# Altium schematic sheet Sheet2.SchDoc: {Title}
size 840 x 594 mm; Date: 2018-01-17; ApprovedBy: {ApprovedBy}; CheckedBy: {TechnicalReference}; Author: {CreatedBy}; DocumentNumber: -; Revision: A; SheetNumber: 2; Title0: {Title0}; DocumentType: {DocumentType}; TechControl: {TechControl}; PageSetup: Record=PageOptions|CenterHorizontal=True|CenterVertical=True|PrintScale=0.96|XCorrection=1.00|YCorrection=1.00|PrintKind=1|BorderSize=5000000|LeftOffset=0|BottomOffset=0|Orientation=2|PaperLength=1000|PaperWidth=1000|Scale=100|PaperSource=7|PrintQuality=-4|MediaType=1|DitherType=10|PaperKind=A3|PrintScaleMode=1; Language: en; ResponsibleDept: DED; DocumentStatus: Released; DecimalNumber: -
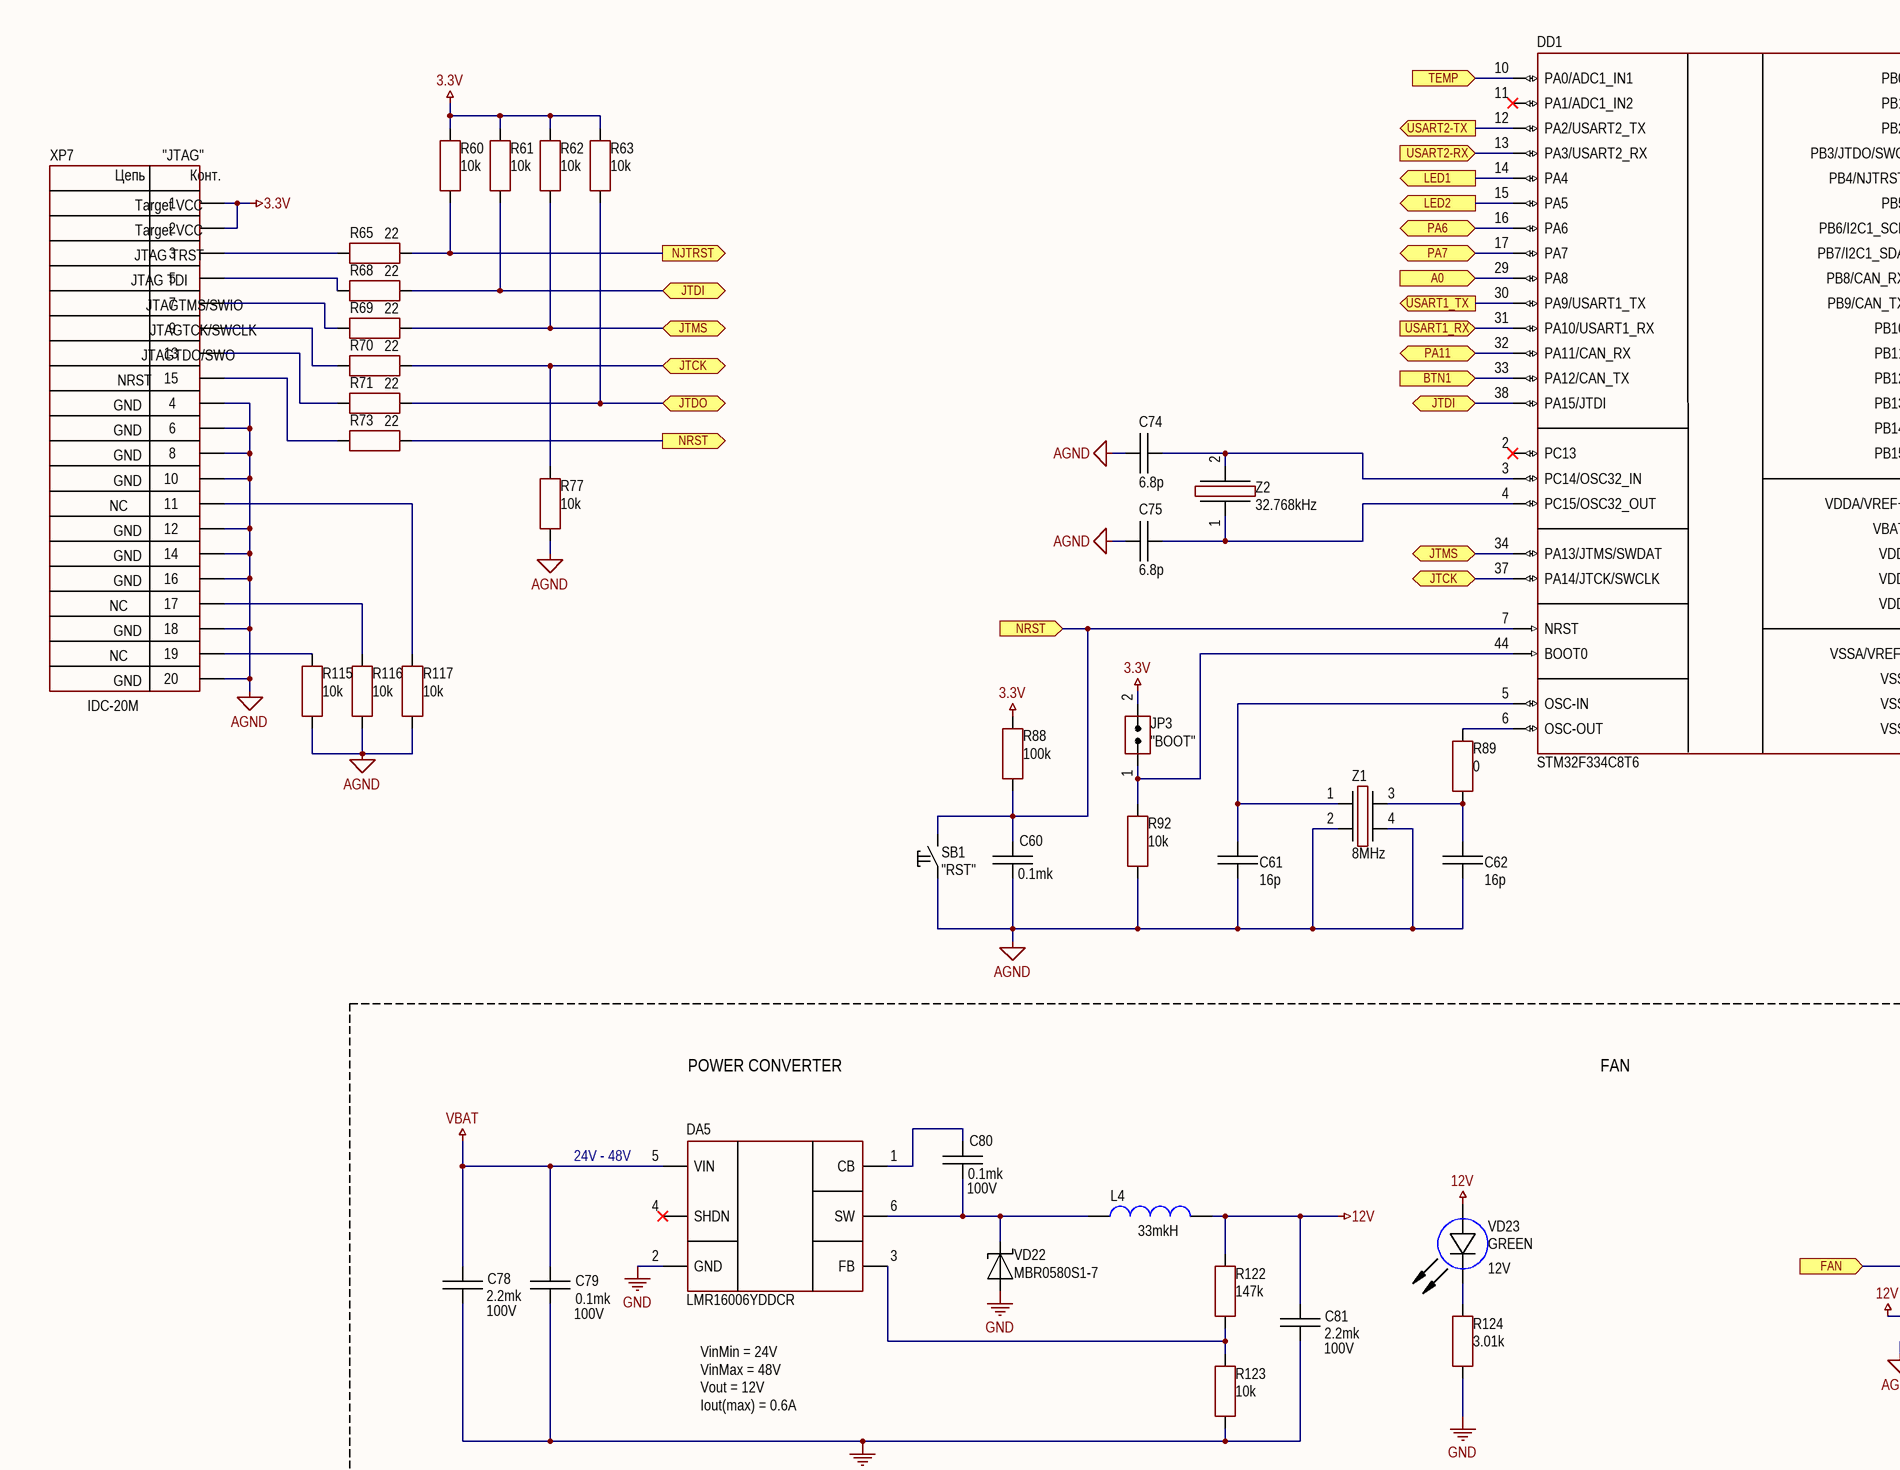
[diagram p0: Sheet2.SchDoc, top left]
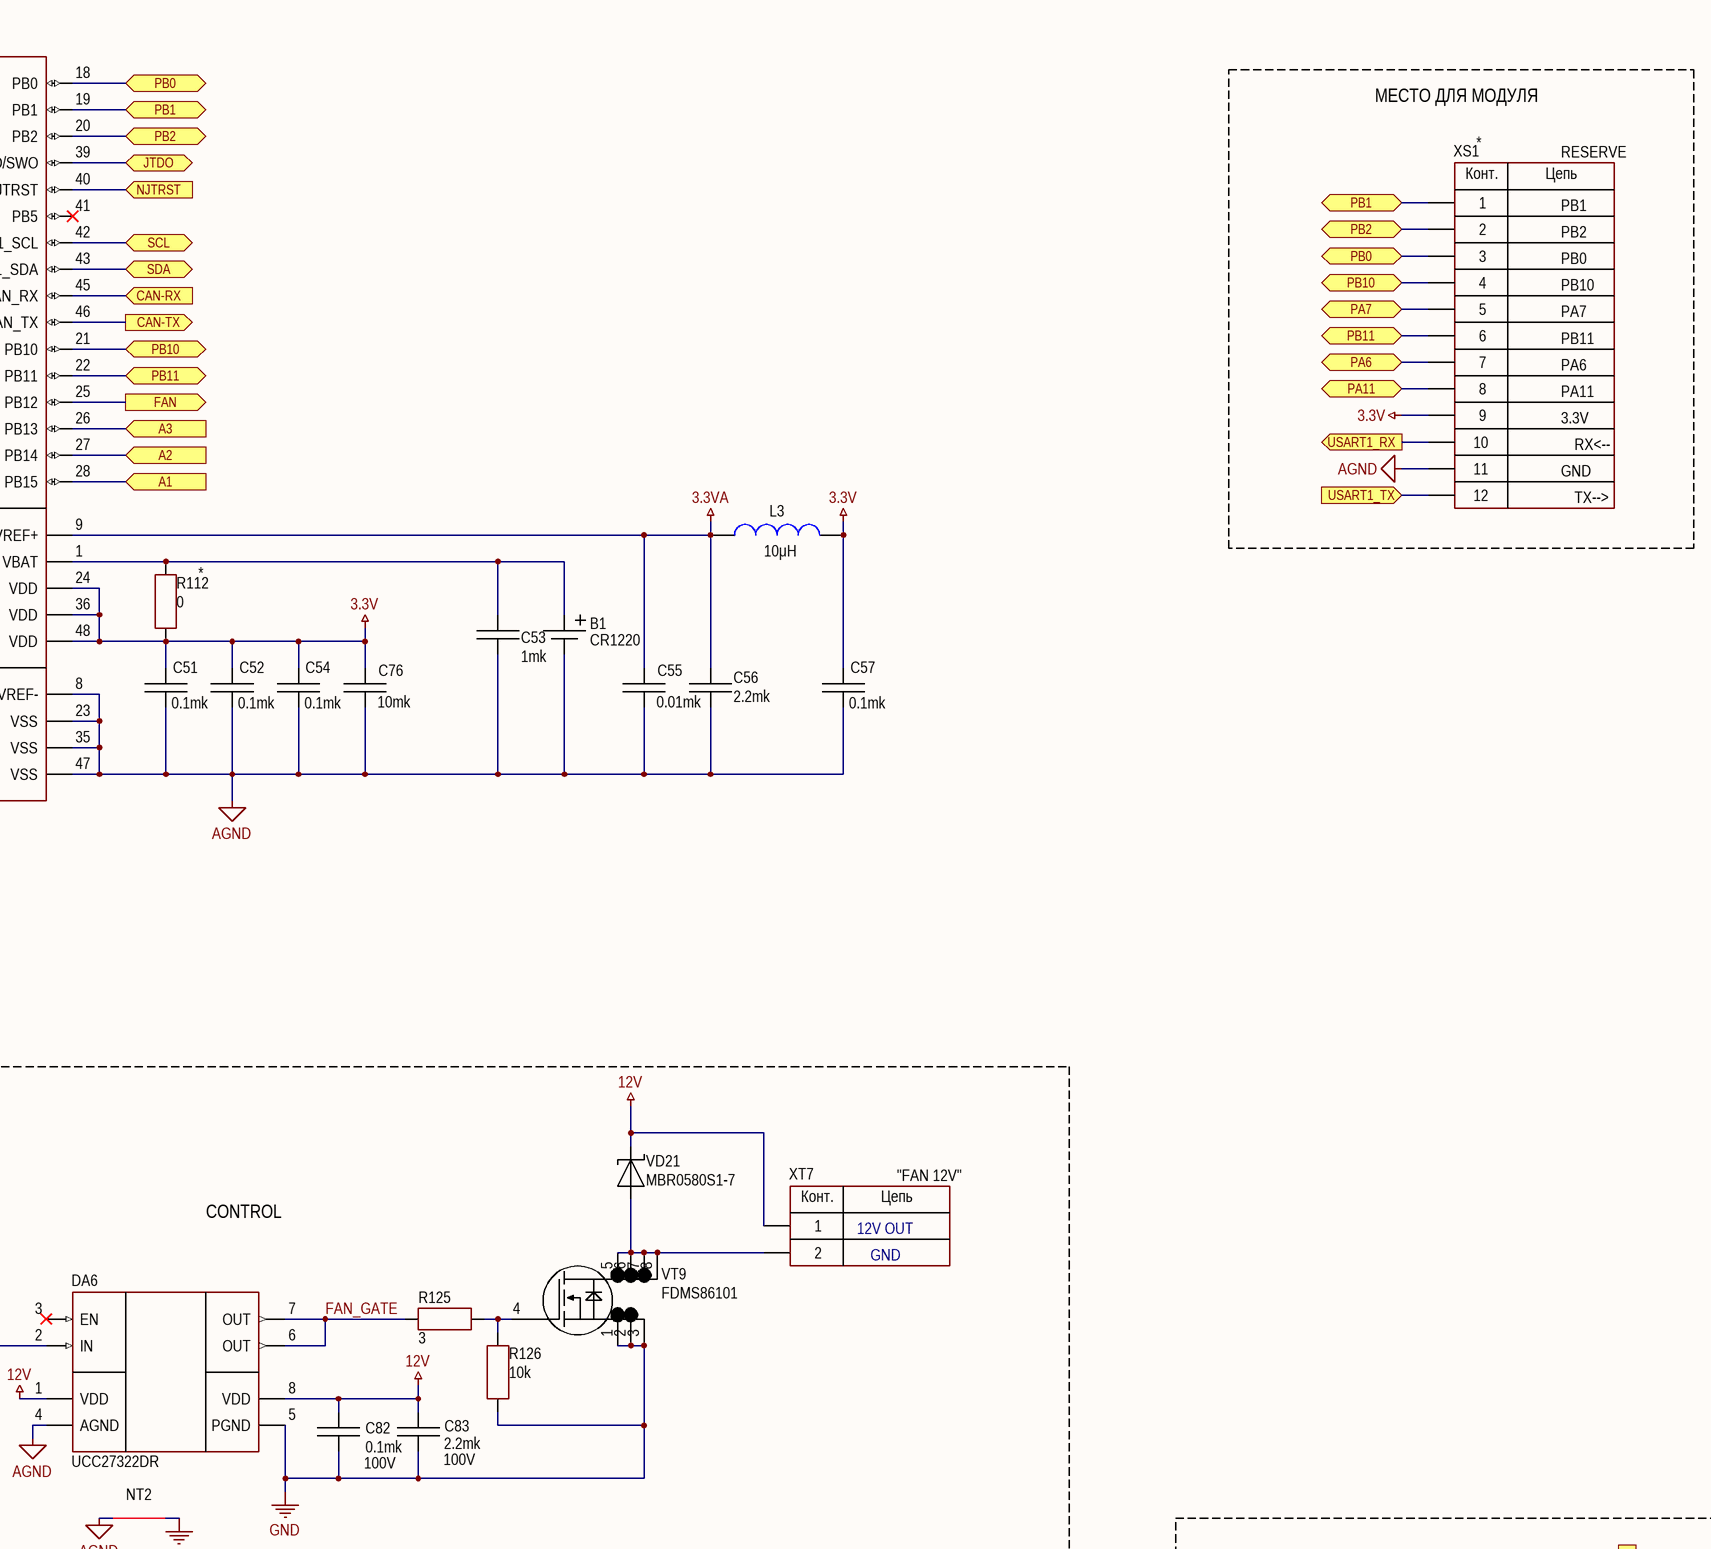
[diagram p1: Sheet2.SchDoc, top right]
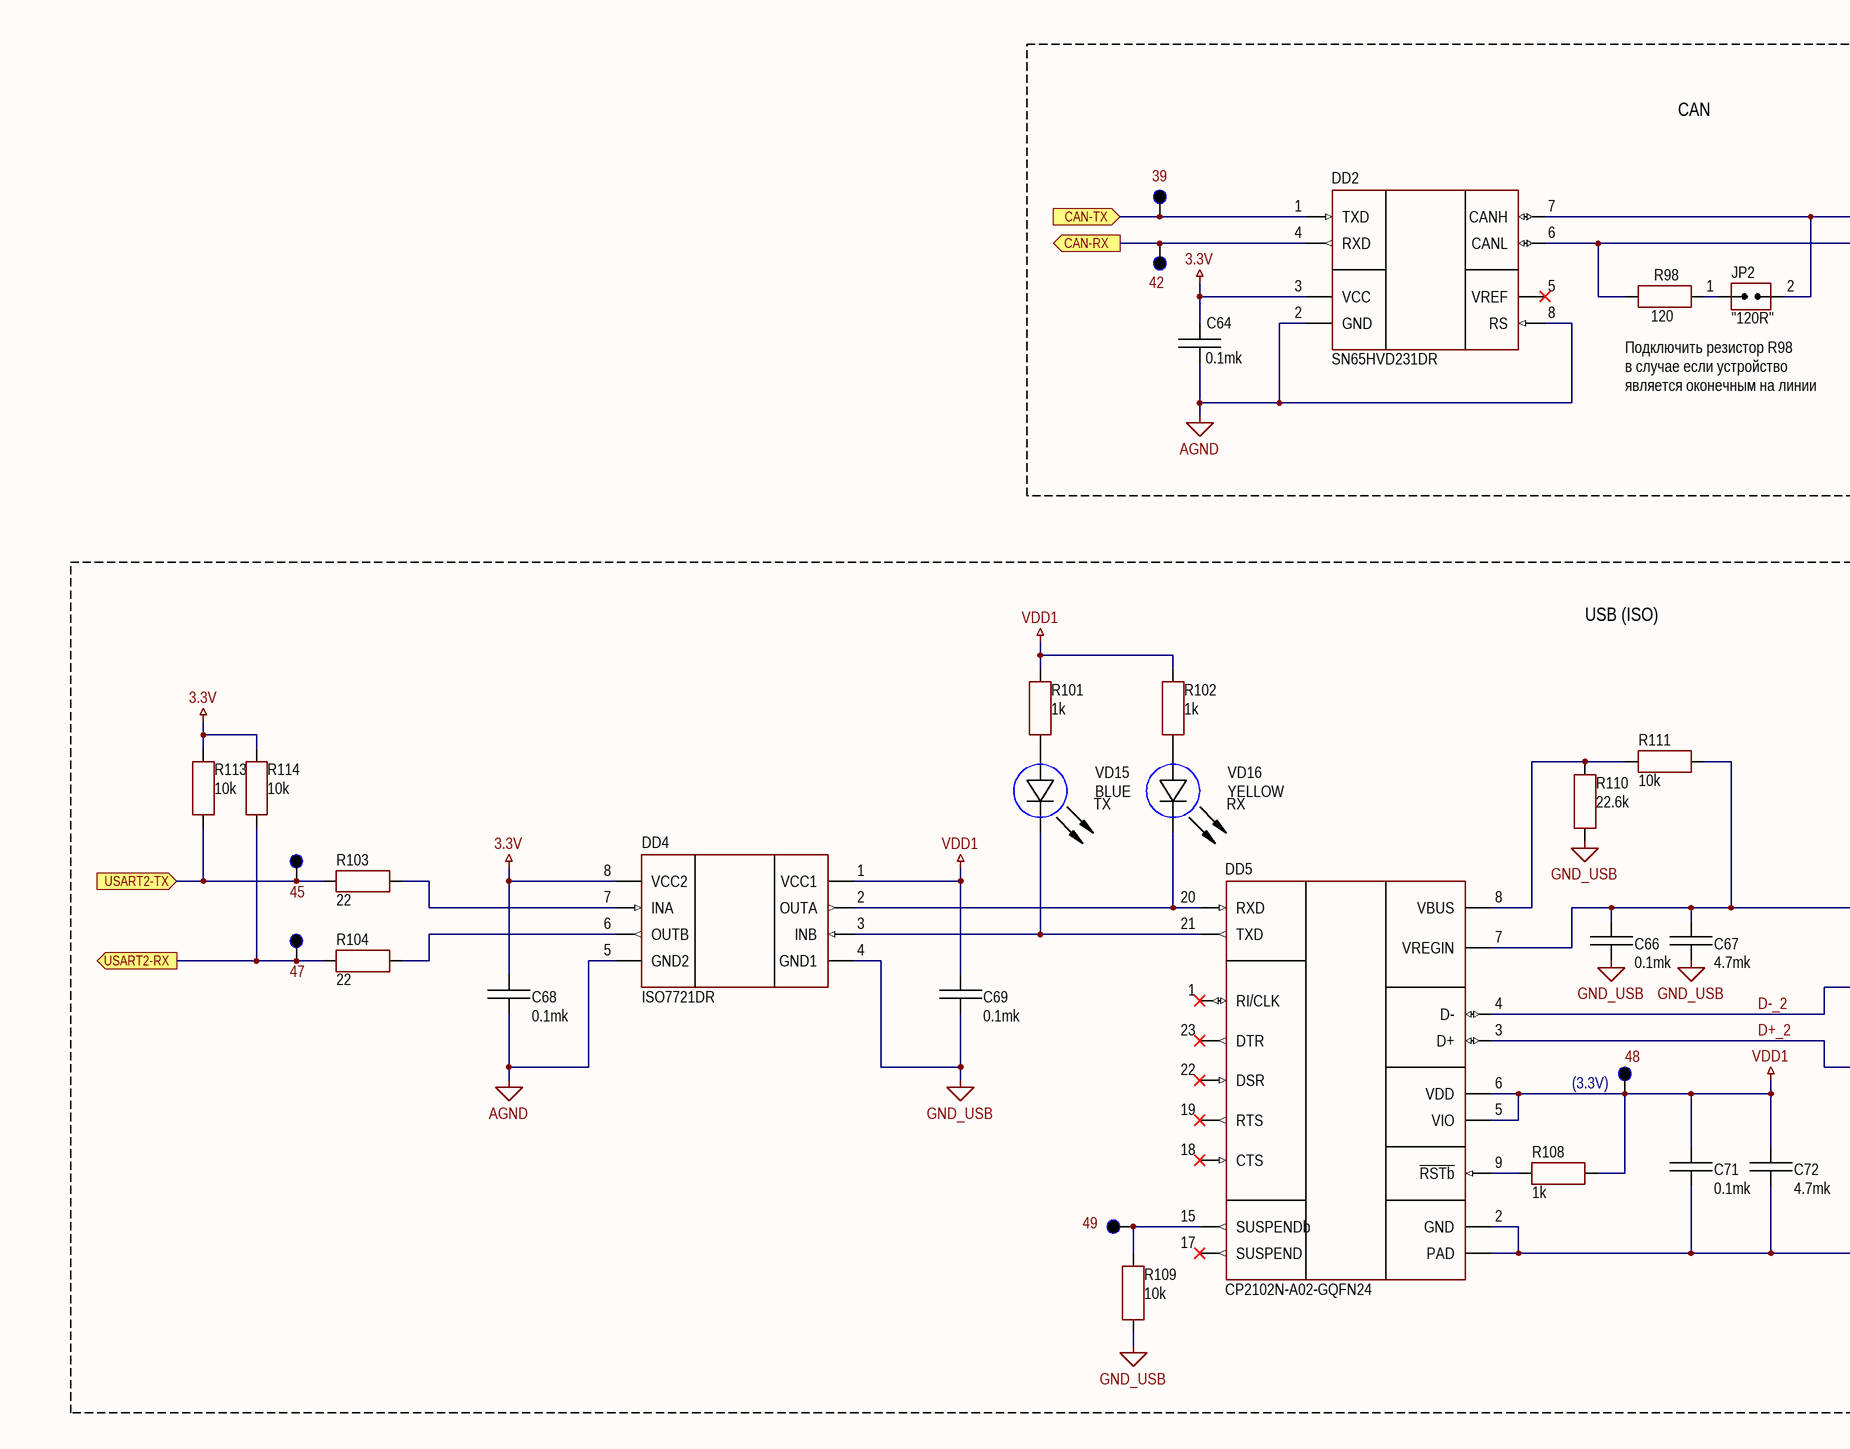
[diagram p2: Sheet2.SchDoc, bottom left]
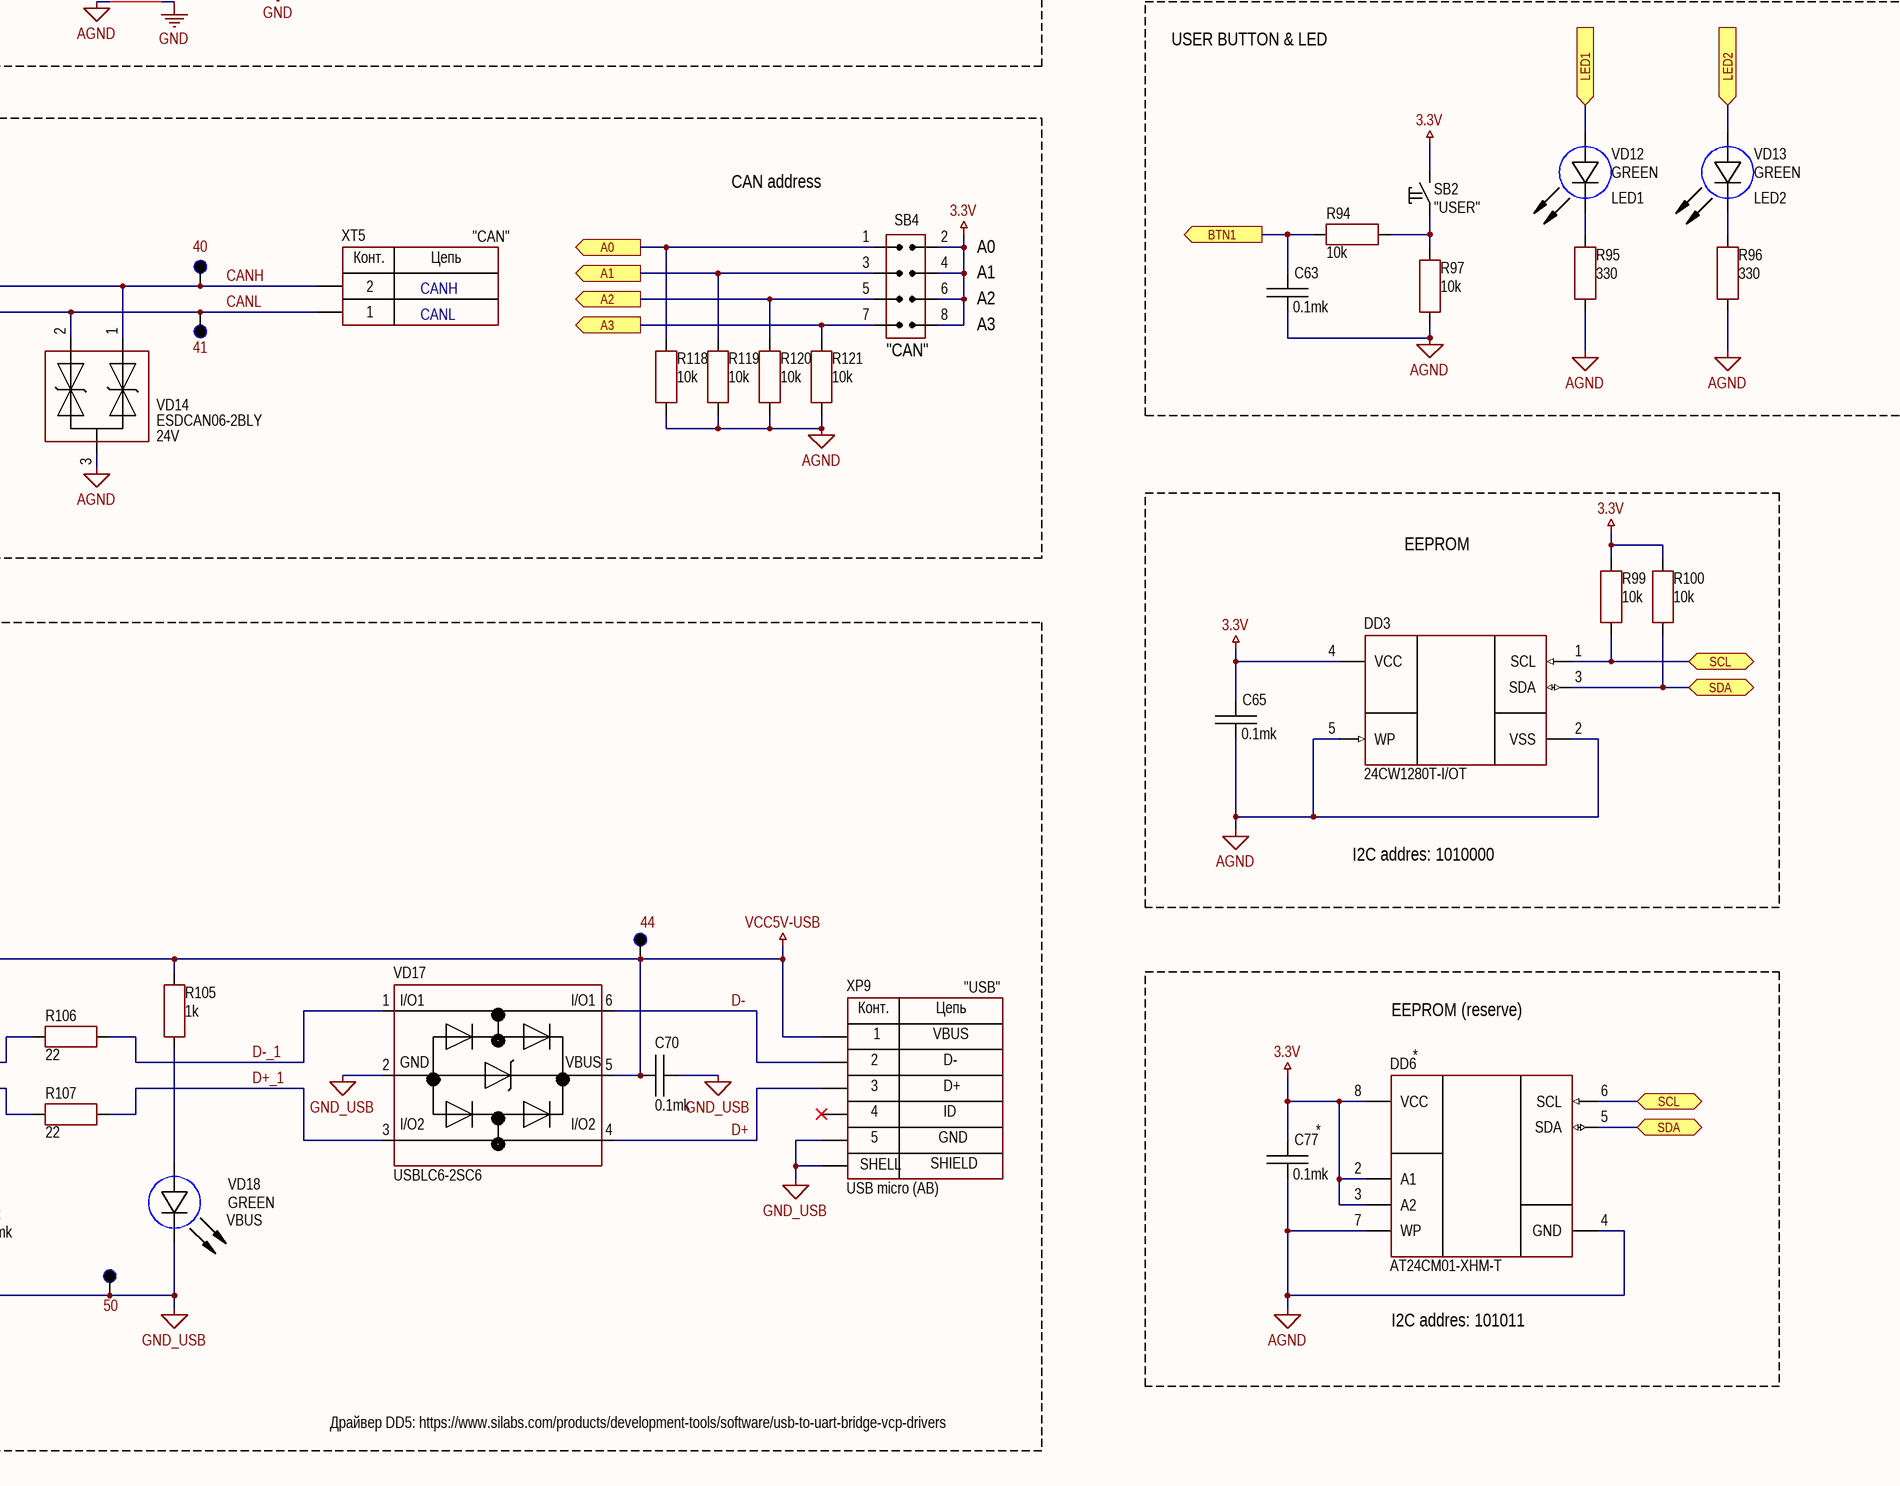
[diagram p3: Sheet2.SchDoc, bottom right]

## Parts
39  test  [TEST_point_SMD]  (value not drawn)  (no BOM)
40  test  [TEST_point_SMD]  (value not drawn)  (no BOM)
41  test  [TEST_point_SMD]  (value not drawn)  (no BOM)
42  test  [TEST_point_SMD]  (value not drawn)  (no BOM)
44  test  [TEST_point_SMD]  (value not drawn)  (no BOM)
45  test  [TEST_point_SMD]  (value not drawn)  (no BOM)
47  test  [TEST_point_SMD]  (value not drawn)  (no BOM)
48  test  [TEST_point_SMD]  (value not drawn)  (no BOM)
49  test  [TEST_point_SMD]  (value not drawn)  (no BOM)
50  test  [TEST_point_SMD]  (value not drawn)  (no BOM)
B1  CR1220  [BAT: S8411-45R]
C51  value 0.1mk  [CAP: 0603]
C52  value 0.1mk  [CAP: 0603]
C53  value 1mk  [CAP: 0603]
C54  value 0.1mk  [CAP: 0603]
C55  value 0.01mk  [CAP: 0603]
C56  value 2.2mk  [CAP: 0603]
C57  value 0.1mk  [CAP: 0603]
C60  value 0.1mk  [CAP: 0603]
C61  value 16p  [CAP: 0603]
C62  value 16p  [CAP: 0603]
C63  value 0.1mk  [CAP: 0603]
C64  value 0.1mk  [CAP: 0603]
C65  value 0.1mk  [CAP: 0603]
C66  value 0.1mk  [CAP: 0603]
C67  value 4.7mk  [CAP: 0805]
C68  value 0.1mk  [CAP: 0603]
C69  value 0.1mk  [CAP: 0603]
C70  value 0.1mk  [CAP: 0603]
C71  value 0.1mk  [CAP: 0603]
C72  value 4.7mk  [CAP: 0805]
C74  value 6.8p  [CAP: 0603]
C75  value 6.8p  [CAP: 0603]
C76  value 10mk  [CAP: 0603]
C77  value 0.1mk  [CAP: 0603]
C78  value 2.2mk  Voltage: 100V  [CAP: 1210]
C79  value 0.1mk  Voltage: 100V  [CAP: 0603]
C80  value 0.1mk  Voltage: 100V  [CAP: 0603]
C81  value 2.2mk  Voltage: 100V  [CAP: 1210]
C82  value 0.1mk  Voltage: 100V  [CAP: 0603]
C83  value 2.2mk  Voltage: 100V  [CAP: 1210]
DA5  (no value)  [SOT23-6 Thin]
DA6  PartNumber: UCC27322DR  [8-SOIC]
DD1  PartNumber: STM32F334C8T6  [48-LQFP]  (hidden comment: IC microcontroller, 32-Bit, Cortex-M4, 72MHz, 64KB, 12KB, 48-LQFP)
DD2  (no value)  [8-SOIC]
DD3  PartNumber: 24CW1280T-I/OT  [SOT23-5]
DD4  (no value)  [8-SOIC]
DD5  PartNumber: CP2102N-A02-GQFN24  [24-QFN]
DD6  EEPROM Memory IC 1Mb (128K x 8) I²C 1MHz 550ns 8-TSSOP  [8-TSSOP]  (value not drawn)
JP2  CommentText: "120R"  [CON: PLS-2]
JP3  CommentText: "BOOT"  [CON: PLS-2]
L3  value 10μH  [IND: 0805]
L4  value 33mkH  [IND: SRU8043]
NT2  (no value)  [NET_TIE]  (net tie, no BOM)
R60  value 10k  [RES: 0603]
R61  value 10k  [RES: 0603]
R62  value 10k  [RES: 0603]
R63  value 10k  [RES: 0603]
R65  value 22  [RES: 0603]
R68  value 22  [RES: 0603]
R69  value 22  [RES: 0603]
R70  value 22  [RES: 0603]
R71  value 22  [RES: 0603]
R73  value 22  [RES: 0603]
R77  value 10k  [RES: 0603]
R88  value 100k  [RES: 0603]
R89  value 0  [RES: 0603]
R92  value 10k  [RES: 0603]
R94  value 10k  [RES: 0603]
R95  value 330  [RES: 0603]
R96  value 330  [RES: 0603]
R97  value 10k  [RES: 0603]
R98  value 120  [RES: 0805]
R99  value 10k  [RES: 0603]
R100  value 10k  [RES: 0603]
R101  value 1k  [RES: 0603]
R102  value 1k  [RES: 0603]
R103  value 22  [RES: 0603]
R104  value 22  [RES: 0603]
R105  value 1k  [RES: 0603]
R106  value 22  [RES: 0603]
R107  value 22  [RES: 0603]
R108  value 1k  [RES: 0603]
R109  value 10k  [RES: 0603]
R110  value 22.6k  [RES: 0603]
R111  value 10k  [RES: 0603]
R112  value 0  [RES: 0603]
R113  value 10k  [RES: 0603]
R114  value 10k  [RES: 0603]
R115  value 10k  [RES: 0603]
R116  value 10k  [RES: 0603]
R117  value 10k  [RES: 0603]
R118  value 10k  [RES: 0603]
R119  value 10k  [RES: 0603]
R120  value 10k  [RES: 0603]
R121  value 10k  [RES: 0603]
R122  value 147k  [RES: 0603]
R123  value 10k  [RES: 0603]
R124  value 3.01k  [RES: 0603]
R125  value 3  [RES: 0603]
R126  value 10k  [RES: 0603]
SB1  CommentText: "RST"  [BUT: 6x6 SMD]
SB2  CommentText: "USER"  [BUT: 6x6 SMD]
SB4  (no value)  [BUT; SW4_1571983_4P_T]
VD12  Color: GREEN  ShowComment: LED1  [LED: 0603G]
VD13  Color: GREEN  ShowComment: LED2  [LED: 0603G]
VD14  Voltage: 24V  PartNumber: ESDCAN06-2BLY  [SOT23]
VD15  Color: BLUE  ShowComment: TX  [LED: 0603B]
VD16  Color: YELLOW  ShowComment: RX  [LED: 0603Y]
VD17  (no value)  [SOT23-6]
VD18  Color: GREEN  ShowComment: VBUS  [LED: 0603G]
VD21  PartNumber: MBR0580S1-7  [DIODE: SMA]
VD22  PartNumber: MBR0580S1-7  [DIODE: SMA]
VD23  Color: GREEN  ShowComment: 12V  [LED: 0603G]
VT9  PartNumber: FDMS86101  [PG-TDSON-8-7]
XP7  PartNumber: IDC-20M  CommentText: "JTAG"  [CON: IDC-20MS]
XP9  TypeConnector: USB micro (AB)  CommentText: "USB"  [CON: microUSB_0475890001]
XS1  CommentText: RESERVE  [CON: PBD-12]
XT5  CommentText: "CAN"  row1: CANH  row2: CANL  [CON: DG350-3.5-02P]
XT7  CommentText: "FAN 12V"  row1: 12V OUT  row2: GND  [CON: DG350-3.5-02P]
Z1  Frequency: 8MHz  [OSC: ECX-53B (3.2x5)]
Z2  Frequency: 32.768kHz  [OSC: 3215]

## Blocks framed on the sheet
24V - 48V: C78-C83 DA5 DA6 L4 NT2 R122-R126 VD21-VD23 VT9 XT7
(3.3V): 44 45 47-50 C66-C72 DD4 DD5 R101-R111 R113 R114 VD15-VD18 XP9

## Ports
A0 (in), A0 (out), A1 (in), A1 (out), A2 (in), A2 (out), A3 (in), A3 (out), BTN1 (in), BTN1 (out), CAN-RX (in), CAN-RX (out), CAN-TX (in), CAN-TX (out), FAN (in), FAN (out), JTCK (bidir), JTDI (bidir), JTDO (bidir), JTMS (bidir), LED1 (in), LED1 (out), LED2 (in), LED2 (out), NJTRST (in), NJTRST (out), NRST (in), NRST (out), PA6 (bidir), PA7 (bidir), PA11 (bidir), PB0 (bidir), PB1 (bidir), PB2 (bidir), PB10 (bidir), PB11 (bidir), SCL (bidir), SDA (bidir), TEMP (in), USART1_RX (in), USART1_RX (out), USART1_TX (in), USART1_TX (out), USART2-RX (in), USART2-RX (out), USART2-TX (in), USART2-TX (out)

## Nets
3.3V: C51.2 C52.2 C54.2 C57.2 C64.2 C65.2 C68.1 C76.2 C77.2 DD1.24(VDD) DD1.36(VDD) DD1.48(VDD) DD2.3(VCC) DD3.4(VCC) DD4.8(VCC2) DD6.2(A1) DD6.3(A2) DD6.8(VCC) JP3.2(IN) L3.1 R60.2 R61.2 R62.2 R63.2 R88.2 R99.1 R100.1 R112.1 R113.2 R114.2 SB2.2 SB4.2(IN) SB4.4(IN) SB4.6(IN) SB4.8(IN) XP7.1 XP7.2 XS1.9
3.3VA: C55.2 C56.2 DD1.9(VDDA/VREF+) L3.2
12V: C81.2 C82.2 C83.2 DA6.1(VDD) DA6.8(VDD) L4.1 R122.2 VD21.2 VD23.1(A) XT7.1
AGND: B1.- C51.1 C52.1 C53.1 C54.1 C55.1 C56.1 C57.1 C60.1 C61.1 C62.1 C63.1 C64.1 C65.1 C68.2 C74.2 C75.2 C76.1 C77.1 DA6.4(AGND) DD1.8(VSSA/VREF-) DD1.23(VSS) DD1.35(VSS) DD1.47(VSS) DD2.2(GND) DD2.8(RS) DD3.2(VSS) DD3.5(WP) DD4.5(GND2) DD6.4(GND) DD6.7(WP) NT2.1 R77.1 R92.1 R95.1 R96.1 R97.1 R115.1 R116.1 R117.1 R118.1 R119.1 R120.1 R121.1 SB1.1 VD14.3 XP7.4 XP7.6 XP7.8 XP7.10 XP7.12 XP7.14 XP7.16 XP7.18 XP7.20 XS1.11 Z1.2 Z1.4
GND: C78.1 C79.1 C81.1 C82.1 C83.1 DA5.2(GND) DA6.5(PGND) NT2.2 R123.2 R124.1 R126.2 VD22.1 VT9.1(S) VT9.2(S) VT9.3(S)
GND_USB: 50.1 C66.2 C67.1 C69.2 C70.2 C71.2 C72.1 DD4.4(GND1) DD5.0(PAD) DD5.2(GND) R109.1 R110.2 VD17.2(GND) VD18.2(C) XP9.0 XP9.5
VBAT: C78.2 C79.2 DA5.5(VIN)
VCC5V-USB: 44.1 C66.1 C67.2 C70.1 DD5.7(VREGIN) R105.1 R111.2 VD17.5(VBUS) XP9.1
VDD1: 48.1 C69.1 C71.1 C72.2 DD4.1(VCC1) DD5.5(VIO) DD5.6(VDD) R101.1 R102.1 R108.1
A0: DD1.29(PA8) R118.2 SB4.1(IN) ; port A0
A1: DD1.28(PB15) R119.2 SB4.3(IN) ; port A1
A2: DD1.27(PB14) R120.2 SB4.5(IN) ; port A2
A3: DD1.26(PB13) R121.2 SB4.7(IN) ; port A3
BTN1: C63.2 DD1.33(PA12/CAN_TX) R94.2 ; port BTN1
CAN-RX: 42.1 DD1.45(PB8/CAN_RX) DD2.4(RXD) ; port CAN-RX
CAN-TX: 39.1 DD1.46(PB9/CAN_TX) DD2.1(TXD) ; port CAN-TX
CANH: 40.1 DD2.7(CANH) JP2.2(IN) VD14.1 XT5.2
CANL: 41.1 DD2.6(CANL) R98.2 VD14.2 XT5.1
D+: VD17.4(I/O2) XP9.3
D+_1: R107.2 VD17.3(I/O2)
D+_2: DD5.3(D+) R107.1
D-: VD17.6(I/O1) XP9.2
D-_1: R106.2 VD17.1(I/O1)
D-_2: DD5.4(D-) R106.1
FAN: DA6.2(IN) DD1.25(PB12) ; port FAN
FAN_GATE: DA6.6(OUT) DA6.7(OUT) R125.2
JTCK: DD1.37(PA14/JTCK/SWCLK) R70.1 R77.2 ; port JTCK
JTDI: DD1.38(PA15/JTDI) R61.1 R68.1 ; port JTDI
JTDO: DD1.39(PB3/JTDO/SWO) R63.1 R71.1 ; port JTDO
JTMS: DD1.34(PA13/JTMS/SWDAT) R62.1 R69.1 ; port JTMS
LED1: DD1.14(PA4) VD12.1(A) ; port LED1
LED2: DD1.15(PA5) VD13.1(A) ; port LED2
NJTRST: DD1.40(PB4/NJTRST) R60.1 R65.1 ; port NJTRST
NRST: C60.2 DD1.7(NRST) R73.1 R88.1 SB1.2 ; port NRST
PA6: DD1.16(PA6) XS1.7 ; port PA6
PA7: DD1.17(PA7) XS1.5 ; port PA7
PA11: DD1.32(PA11/CAN_RX) XS1.8 ; port PA11
PB0: DD1.18(PB0) XS1.3 ; port PB0
PB1: DD1.19(PB1) XS1.1 ; port PB1
PB2: DD1.20(PB2) XS1.2 ; port PB2
PB10: DD1.21(PB10) XS1.4 ; port PB10
PB11: DD1.22(PB11) XS1.6 ; port PB11
SCL: DD1.42(PB6/I2C1_SCL) DD3.1(SCL) DD6.6(SCL) R99.2 ; port SCL
SDA: DD1.43(PB7/I2C1_SDA) DD3.3(SDA) DD6.5(SDA) R100.2 ; port SDA
TEMP: DD1.10(PA0/ADC1_IN1) ; port TEMP
USART1_RX: DD1.31(PA10/USART1_RX) XS1.10 ; port USART1_RX
USART1_TX: DD1.30(PA9/USART1_TX) XS1.12 ; port USART1_TX
USART2-RX: 47.1 DD1.13(PA3/USART2_RX) R104.1 R114.1 ; port USART2-RX
USART2-TX: 45.1 DD1.12(PA2/USART2_TX) R103.1 R113.1 ; port USART2-TX
Net49_1: 49.1 DD5.15(SUSPENDb) R109.2
NetB1_+: B1.+ C53.2 DD1.1(VBAT) R112.2
NetC61_2: C61.2 DD1.5(OSC-IN) Z1.1
NetC62_2: C62.2 R89.2 Z1.3
NetC74_1: C74.1 DD1.3(PC14/OSC32_IN) Z2.2
NetC75_1: C75.1 DD1.4(PC15/OSC32_OUT) Z2.1
NetC80_1: C80.1 DA5.6(SW) L4.2 VD22.2
NetC80_2: C80.2 DA5.1(CB)
NetDA5_3: DA5.3(FB) R122.1 R123.1
NetDD1_6: DD1.6(OSC-OUT) R89.1
NetDD1_44: DD1.44(BOOT0) JP3.1(IN) R92.2
NetDD4_2: DD4.2(OUTA) DD5.20(RXD) VD16.2(C)
NetDD4_3: DD4.3(INB) DD5.21(TXD) VD15.2(C)
NetDD4_6: DD4.6(OUTB) R104.2
NetDD4_7: DD4.7(INA) R103.2
NetDD5_8: DD5.8(VBUS) R110.1 R111.1
NetDD5_9: DD5.9(~{RSTb}) R108.2
NetJP2_1: JP2.1(IN) R98.1
NetR65_2: R65.2 XP7.3
NetR68_2: R68.2 XP7.5
NetR69_2: R69.2 XP7.7
NetR70_2: R70.2 XP7.9
NetR71_2: R71.2 XP7.13
NetR73_2: R73.2 XP7.15
NetR94_1: R94.1 R97.2 SB2.1
NetR95_2: R95.2 VD12.2(C)
NetR96_2: R96.2 VD13.2(C)
NetR101_2: R101.2 VD15.1(A)
NetR102_2: R102.2 VD16.1(A)
NetR105_2: R105.2 VD18.1(A)
NetR115_2: R115.2 XP7.19
NetR116_2: R116.2 XP7.17
NetR117_2: R117.2 XP7.11
NetR124_2: R124.2 VD23.2(C)
NetR125_1: R125.1 R126.1 VT9.4(G)
NetVD21_1: VD21.1 VT9.5(D) VT9.6(D) VT9.7(D) VT9.8(D) XT7.2

Not connected (* = marked no-connect by the designer): DA5 4(SHDN)*; DA6 3(EN)*; DD1 2(PC13)* 11(PA1/ADC1_IN2)* 41(PB5)*; DD2 5(VREF)*; DD5 1(RI/CLK)* 17(SUSPEND)* 18(CTS)* 19(RTS)* 22(DSR)* 23(DTR)*; XP9 4*

## Notes on the sheet
- МЕСТО ДЛЯ МОДУЛЯ РАСШИРЕНИЯ
- (near XS1) *
- Target VCC
- PB1
- JTAG TRST
- PB2
- PB0
- PB10
- JTAG TDI
- JTAGTMS/SWIO
- (near XP7) JTAGTCK/SWCLK
- PA7
- PB11
- NRST
- JTAGTDO/SWO
- PA6
- PA11
- 3.3V
- GND
- RX<--
- NC
- TX-->
- (near R112) *
- POWER CONVERTER
- FAN
- CONTROL
- VinMin = 24V
  VinMax = 48V
  Vout = 12V
  Iout(max) = 0.6A
- USER BUTTON & LED
- CAN
- CAN address
- A0
- A1
- A2
- (near SB4) "CAN"
- A3
- Подключить резистор R98
  в случае если устройство
  является оконечным на линии
- (near R99) EEPROM
- USB (ISO)
- I2C addres: 1010000
- EEPROM (reserve)
- (near DD6) *
- (near C77) *
- I2C addres: 101011
- Драйвер DD5: https://www.silabs.com/products/development-tools/software/usb-to-uart-bridge-vcp-drivers
- Перв. примен.
- Справ. №
- Подп. и дата
- Инв. № дубл.
- Взам. инв. №
- Инв. № подл.
- Изм.
- Лист
- № докум.
- Подп.
- Дата
- 2.106-A2
- Копировал
- Формат А1
- (in symbol Connector_terminal_2pin) Конт.; Цепь
- (in symbol Connector_USB_micro_AB) Конт.; Цепь; VBUS; D-; D+; ID; GND; SHELL; SHIELD
- (in symbol IDC-20) Цепь; Конт.
- (in symbol PBD-12) Конт.; Цепь

## Library data of the parts
39-42 44 45 47-50 = TEST point: Контактная площадка без компонента
B1 = CR1220: Holder: S8411-45R HARWIN; Value: 3V; Battery: CR1220 MFR.SC "RENATA"; HolderAnalog: KLS5-CR1220-02; Pattern/Footprint: CR1220; HelpURL: https://www.electronshik.ru/item/RENATA/CR1220%20MFR.IB; HelpURL1: https://www.digikey.com/product-detail/en/harwin-inc/S8411-45R/952-1745-2-ND/3131055
C51 C52 C54 C57 C60 C63-C66 C68-C71 C77 = Ceramic_0603: Manufacturer: AVX; PartNumber: 0603YC104KAT2A; ValueManufacturerPartNumber: CAP CER, 0.1mk, X7R, ±10%, 16V, 0603; TypeCapacitor: CAP CER; Tolerance: ±10%; TypeDielectric: X7R; Voltage: 16V; Package: 0603; HelpURL: https://www.digikey.com/product-detail/en/avx-corporation/0603YC104KAT2A/478-1239-1-ND/564271; Temperature: -55...+125°C
  C70 C71: ClassName: Polygon_direct
C53 = Ceramic_0603: Manufacturer: AVX; PartNumber: 0603YC105KAT2A; ValueManufacturerPartNumber: CAP CER, 1mk, X7R, ±10%, 16V, 0603; TypeCapacitor: CAP CER; Tolerance: ±10%; TypeDielectric: X7R; Voltage: 16V; Package: 0603; HelpURL: https://www.digikey.com/product-detail/en/avx-corporation/0603YC105KAT2A/478-5010-1-ND/1888221; Temperature: -55...+125°C
C55 = Ceramic_0603: Manufacturer: AVX; PartNumber: 06031C103KAT2A; ValueManufacturerPartNumber: CAP CER, 0.01mk, X7R, ±10%, 100V, 0603; TypeCapacitor: CAP CER; Tolerance: ±10%; TypeDielectric: X7R; Voltage: 100V; Package: 0603; HelpURL: https://www.digikey.com/product-detail/en/avx-corporation/06031C103KAT2A/478-1205-2-ND/563315; Temperature: -55...+125°C
C56 = Ceramic_0603: Manufacturer: AVX; PartNumber: 0603ZD225KAT2A; ValueManufacturerPartNumber: CAP CER, 2.2mk, X5R, ±10%, 10V, 0603; TypeCapacitor: CAP CER; Tolerance: ±10%; TypeDielectric: X5R; Voltage: 10V; Package: 0603; HelpURL: https://www.digikey.com/product-detail/en/avx-corporation/0603ZD225KAT2A/478-6212-1-ND/2391411; Temperature: -55...+85°C
C61 C62 = Ceramic_0603: Manufacturer: AVX; PartNumber: 06035A160JAT2A; ValueManufacturerPartNumber: CAP CER, 16p, NP0, ±5%, 50V, 0603; TypeCapacitor: CAP CER; Tolerance: ±5%; TypeDielectric: NP0; Voltage: 50V; Package: 0603; HelpURL: https://www.digikey.com/product-detail/en/avx-corporation/06035A160JAT2A/478-10292-1-ND/6797449; Temperature: -55...+125°C
C67 C72 = Ceramic_0805: Manufacturer: AVX; PartNumber: 0805YC475KAT2A; ValueManufacturerPartNumber: CAP CER, 4.7mk, X7R, ±10%, 16V, 0805; TypeCapacitor: CAP CER; Tolerance: ±10%; TypeDielectric: X7R; Voltage: 16V; Package: 0805; HelpURL: https://www.digikey.com/product-detail/en/avx-corporation/0805YC475KAT2A/478-5722-1-ND/2136330; Temperature: -55...+125°C
C74 C75 = Ceramic_0603: Manufacturer: YAGEO; PartNumber: CC0603DRNPO9BN6R8; ValueManufacturerPartNumber: CAP CER, 6.8p, NP0, ±0.5pF, 50V, 0603; TypeCapacitor: CAP CER; Tolerance: ±0.5pF; TypeDielectric: NP0; Voltage: 50V; Package: 0603; HelpURL: https://www.electronshik.ru/item/YAG/CC0603DRNPO9BN6R8; Temperature: -55...+125°C
C76 = Ceramic_0603: Manufacturer: AVX; PartNumber: 0603ZD106MAT2A; ValueManufacturerPartNumber: CAP CER, 10mk, X5R, ±10%, 10V, 0603; TypeCapacitor: CAP CER; Tolerance: ±10%; TypeDielectric: X5R; Voltage: 10V; Package: 0603; HelpURL: https://www.digikey.com/product-detail/en/avx-corporation/0603ZD106MAT2A/478-8050-1-ND/3900666; Temperature: -55...+85°C
C78 C81 C83 = Ceramic_1210: Manufacturer: AVX; PartNumber: 12101C225KAT2A; ValueManufacturerPartNumber: CAP CER, 2.2mk, X7R, ±10%, 100V, 1210; TypeCapacitor: CAP CER; Tolerance: ±10%; TypeDielectric: X7R; Package: 1210; HelpURL: https://www.digikey.com/product-detail/en/avx-corporation/12101C225KAT2A/478-7974-1-ND/3881597; Temperature: -55...+125°C; ClassName: Polygon_direct
C79 C80 C82 = Ceramic_0603: Manufacturer: AVX; PartNumber: 06031C104KAT2A; ValueManufacturerPartNumber: CAP CER, 0.1mk, X7R, ±10%, 100V, 0603; TypeCapacitor: CAP CER; Tolerance: ±10%; TypeDielectric: X7R; Package: 0603; HelpURL: https://www.digikey.com/product-detail/en/avx-corporation/06031C104KAT2A/478-10047-1-ND/6564270; Temperature: -55...+125°C
  C79 C82: ClassName: Polygon_direct
DA5 = LMR16006YDDCR: Buck converter; Manufacturer: Texas Instruments; ValueManufacturerPartNumber: DC/DC buck converter, SOT23-6; VoltageInput: 4...60V; Frequency: 2.1MHz; CurrentOutput: 0.6A; VoltageOutput: 0.765...55V; HelpURL: https://www.digikey.com/product-detail/en/texas-instruments/LMR16006YDDCR/296-40294-1-ND/5178171; Package: SOT23-6; ComponentType: DC/DC buck converter; Temperature: -40...+125°C; PartNumber: LMR16006YDDCR; ClassName: Polygon_direct
DA6 = UCC27322D: Gate driver; Manufacturer: Texas Instruments; ValueManufacturerPartNumber: Low side gate driver, P+N channel, 500kHz, ±9A, supply 4...15V, -40...+125°C, 8-SOIC; VoltageSupply: supply 4...15V; Frequency: 500kHz; CurrentOutput: ±9A; VoltageWork: P+N channel; HelpURL: https://www.digikey.com/product-detail/en/texas-instruments/UCC27322D/296-13673-5-ND/509705; Package: 8-SOIC; ComponentType: Low side gate driver; Temperature: -40...+125°C; ClassName: Polygon_direct
DD1 = STM32F334C4T6: Cortex-M4; Manufacturer: STMicroelectronics; Supply: 2...3.6V; HelpURL: https://www.digikey.com/products/en?keywords=STM32F334C4T6; Package: 48-LQFP; ComponentType: IC microcontroller; ValueManufacturerPartNumber: IC microcontroller, 32-Bit, Cortex-M4, 72MHz, 64KB, 12KB, 48-LQFP; Temperature: -40...+85°C; Speed: 72MHz; CoreSize: 32-Bit; MemoryROM: 64KB; MemoryRAM: 12KB; CoreProcessor: Cortex-M4
DD2 = SN65HVD231DR: CAN; Manufacturer: Texas Instruments; ValueManufacturerPartNumber: IC CAN transceiver, 8-SOIC; Supply: 3...3.6V; DataRate: 1Mbps; TypeDuplex: Half-duplex; HelpURL: https://www.digikey.com/product-detail/en/texas-instruments/SN65HVD231DR/296-26343-1-ND/2254977; Package: 8-SOIC; ComponentType: IC CAN transceiver; Temperature: -40...+85°C; PartNumber: SN65HVD231DR
DD3 = 24AA01T: EEPROM; Manufacturer: Microchip Technology; ValueManufacturerPartNumber: EEPROM, 128KB (16Kx8), 400 kHz, I2C, SOT-23-5; Supply: 1.7...5.5V; Speed: 400 kHz; InterfaceData: I2C; MemorySize: 128KB (16Kx8); HelpURL: https://www.digikey.com/product-detail/en/microchip-technology/24CW1280T-I-OT/24CW1280T-I-OTDKR-ND/9607118; Package: SOT-23-5; ComponentType: EEPROM; Temperature: -40...+85°C
DD4 = ISO7721DR: Digital isolator; Manufacturer: Texas Instruments; ValueManufacturerPartNumber: IC digital isolator, 8-SOIC; Supply: 2.25...5.5V; DataRate: 100Mbps; Isolation: 3000Vrms; HelpURL: https://www.digikey.com/product-detail/en/texas-instruments/ISO7721DR/296-48296-1-ND/8347715; Package: 8-SOIC; ComponentType: IC digital isolator; Temperature: -55...+125°C; PartNumber: ISO7721DR
DD5 = CP2102N_QFN24: USB-to-UART; Manufacturer: Silicon Labs; ValueManufacturerPartNumber: USB Bridge, USB to UART, USB2.0, 24-QFN(4x4); Supply: 3...3.6V; HelpURL: https://www.digikey.com/product-detail/en/silicon-labs/CP2102N-A02-GQFN24/336-5887-ND/9863476; Package: 24-QFN(4x4); ComponentType: USB Bridge, USB to UART; Temperature: -40...+85°C; Standard: USB2.0
DD6 = AT24CM01-XHM-T: EEPROM; Manufacturer: Microchip Technology; Supply: 1.7...5.5V; InterfaceData: I2C; HelpURL: https://www.digikey.com/product-detail/en/microchip-technology/AT24CM01-XHM-T/AT24CM01-XHM-TTR-ND/3913189; Package: 8-TSSOP; ComponentType: EEPROM; ValueManufacturerPartNumber: EEPROM Memory IC 1Mb (128K x 8) I²C 1MHz 550ns 8-TSSOP; Temperature: -40...+85°C; Speed: 1MHz; MemorySize: 1Mb (128K x 8); PartNumber: AT24CM01-XHM-T
JP2 JP3 = Jumper_single: Manufacturer: Würth Elektronik; PartNumber: 61300411121; ValueManufacturerPartNumber: PLS-2 SINGLE ROW, 2pin, 2.54mm, 500VAC, 3A; CurrentMax: 3A; Multichannel: 2pin; Pitch: 2.54mm; TypeConnector: PLS-2 SINGLE ROW; VoltageMax: 500VAC; HelpURL: https://www.digikey.com/product-detail/en/w-rth-elektronik/61300411121/732-5317-ND/4846827
L3 = Inductor_0805: Manufacturer: Murata Electronics; PartNumber: LQM21DH100M70L; ValueManufacturerPartNumber: Fixed inductor, 10μH, ±20%, 0805, 250mA; TypeInductor: Fixed inductor; MaxCurrent: 250mA; Tolerance: ±20%; Package: 0805; HelpURL: https://www.digikey.com/product-detail/en/murata-electronics/LQM21DH100M70L/490-18463-1-ND/10135474; Temperature: -55...+125°C
L4 = Inductor_R22.9/14/7.62: Manufacturer: Bourns Inc.; PartNumber: SRU8043-330Y; ValueManufacturerPartNumber: Fixed inductor, 33mkH, ±15%, SMD Nonstandard, Ferrite, , 1.7A; TypeInductor: Fixed inductor; TypeMatiriel: Ferrite; Current: 1.7A; Tolerance: ±15%; Package: SMD Nonstandard; HelpURL: https://www.digikey.com/product-detail/en/bourns-inc/SRU8043-330Y/SRU8043-330YCT-ND/2353063; ClassName: Polygon_direct
NT2 = NetTie: ClassName: Polygon_direct
R60-R63 R77 R92 R94 R97 R99 R100 R109 R111 R113-R121 R123 R126 = Resistor_0603: Manufacturer: Vishay; PartNumber: CRCW060310K0JNEAC; ValueManufacturerPartNumber: Res, SMD, 10k, ±5%, 0603, 0.1W; TypeResistor: Res, SMD; Power: 0.1W; Tolerance: ±5%; Package: 0603; HelpURL: https://www.digikey.com/product-detail/en/vishay-dale/CRCW060310K0JNEAC/541-3957-1-ND/7928640; Temperature: -55...+125°C
R65 R68-R71 R73 R103 R104 R106 R107 = Resistor_0603: Manufacturer: Vishay; PartNumber: CRCW060322R0JNEA; ValueManufacturerPartNumber: Res, SMD, 22, ±5%, 0603, 0.1W; TypeResistor: Res, SMD; Power: 0.1W; Tolerance: ±5%; Package: 0603; HelpURL: https://www.digikey.com/product-detail/en/vishay-dale/CRCW060322R0JNEA/541-22GCT-ND/1179329; Temperature: -55...+125°C
R88 = Resistor_0603: Manufacturer: Vishay; PartNumber: CRCW0603100KFKEA; ValueManufacturerPartNumber: Res, SMD, 100k, ±1%, 0603, 0.1W; TypeResistor: Res, SMD; Power: 0.1W; Tolerance: ±1%; Package: 0603; HelpURL: https://www.digikey.com/product-detail/en/vishay-dale/CRCW0603100KFKEA/541-100KHCT-ND/1180038; Temperature: -55...+125°C
R89 R112 = Resistor_0603: Manufacturer: Vishay; PartNumber: CRCW06030000Z0EA; ValueManufacturerPartNumber: Res, SMD, 0, ±1%, 0603, 0.1W; TypeResistor: Res, SMD; Power: 0.1W; Tolerance: ±1%; Package: 0603; HelpURL: https://www.digikey.com/product-detail/en/vishay-dale/CRCW06030000Z0EA/541-0.0GCT-ND/1179296; Temperature: -55...+125°C
R95 R96 = Resistor_0603: Manufacturer: Vishay; PartNumber: CRCW0603330RFKEAC; ValueManufacturerPartNumber: Res, SMD, 330, ±1%, 0603, 0.1W; TypeResistor: Res, SMD; Power: 0.1W; Tolerance: ±1%; Package: 0603; HelpURL: https://www.digikey.com/product-detail/en/vishay-dale/CRCW0603330RFKEAC/541-4026-1-ND/7928709; Temperature: -55...+125°C
R98 = Resistor_0805: Manufacturer: Vishay; PartNumber: CRCW0805120RJNEA; ValueManufacturerPartNumber: Resistor film, 120, ±5%, 0805, 0.125W; TypeResistor: Resistor film; Power: 0.125W; Tolerance: ±5%; Package: 0805; HelpURL: https://www.digikey.com/product-detail/en/vishay-dale/CRCW0805120RJNEA/541-120ACT-ND/1180318; Temperature: -55...+125°C
R101 R102 R105 R108 = Resistor_0603: Manufacturer: Vishay; PartNumber: CRCW06031K00FKEA; ValueManufacturerPartNumber: Res, SMD, 1k, ±1%, 0603, 0.1W; TypeResistor: Res, SMD; Power: 0.1W; Tolerance: ±1%; Package: 0603; HelpURL: https://www.digikey.com/product-detail/en/vishay-dale/CRCW06031K00FKEA/541-1.00KHCT-ND/1179809; Temperature: -55...+125°C
  R105: ClassName: Polygon_direct
R110 = Resistor_0603: Manufacturer: Vishay; PartNumber: CRCW060322K6FKEA; ValueManufacturerPartNumber: Res, SMD, 22.6k, ±1%, 0603, 0.1W; TypeResistor: Res, SMD; Power: 0.1W; Tolerance: ±1%; Package: 0603; HelpURL: https://www.digikey.com/product-detail/en/vishay-dale/CRCW060322K6FKEA/541-22.6KHCT-ND/1179962; Temperature: -55...+125°C
R122 = Resistor_0603: Manufacturer: YAGEO; PartNumber: RC0603FR-07147KL; ValueManufacturerPartNumber: Res, SMD, 147k, ±1%, 0603, 0.1W; TypeResistor: Res, SMD; Power: 0.1W; Tolerance: ±1%; Package: 0603; HelpURL: https://www.electronshik.ru/item/YAG/RC0603FR-07147KL; Temperature: -55...+125°C
R124 = Resistor_0603: Manufacturer: Vishay; PartNumber: CRCW06033K01FKEA; ValueManufacturerPartNumber: Res, SMD, 3.01k, ±1%, 0603, 0.1W; TypeResistor: Res, SMD; Power: 0.1W; Tolerance: ±1%; Package: 0603; HelpURL: https://www.digikey.com/product-detail/en/vishay-dale/CRCW06033K01FKEA/541-3.01KHCT-ND/1179862; Temperature: -55...+125°C
R125 = Resistor_0603: Manufacturer: Vishay; PartNumber: CRCW06033R00JNEA; ValueManufacturerPartNumber: Res, SMD, 3, ±5%, 0603, 0.1W; TypeResistor: Res, SMD; Power: 0.1W; Tolerance: ±5%; Package: 0603; HelpURL: https://www.digikey.com/product-detail/en/vishay-dale/CRCW06033R00JNEA/541-3.0GCT-ND/1179308; Temperature: -55...+125°C
SB1 SB2 = Button_tactile: Manufacturer: TE Connectivity; ValueManufacturerPartNumber: Tactile button, 6x6mm; PartNumber: FSM2JSMAATR; TypeButton: Tactile button; HelpURL: https://www.digikey.com/product-detail/en/te-connectivity-alcoswitch-switches/FSM2JSMAATR/450-1792-1-ND/3503931; Package: 6x6mm
SB4 = Button_switch: Manufacturer: TE Connectivity; ValueManufacturerPartNumber: DIP switch, 4pin, 24VDC, 25mA, -40...+85°C; PartNumber: 1571983-4; TypeButton: DIP switch; VoltageMax: 24VDC; CurrentMax: 25mA; Multichannel: 4pin; HelpURL: https://www.chipdip.ru/product/tyco-1571983-4; Temperature: -40...+85°C
VD12 VD13 VD18 VD23 = LED_single: Manufacturer: Wurth; ValueManufacturerPartNumber: LED, 0603, GREEN; PartNumber: 150060VS75000; TypeDiode: LED; Current: 20mA; VoltageDrop: 2V; Package: 0603; HelpURL: https://www.digikey.com/product-detail/en/wurth-electronics-inc/150060VS75000/732-4980-1-ND/4489904; Temperature: -55...+150°C
VD14 = TVS_array: Manufacturer: STMicroelectronics; ValueManufacturerPartNumber: TVS diode, 24V, 230W peak, 3A, 13pF, SOT-23, -40...+150°C; TypeDiode: TVS diode; Current: 230W peak; VoltageDrop: 3A; RecoveryTime: 13pF; Package: SOT-23; HelpURL: https://www.digikey.com/product-detail/en/stmicroelectronics/ESDCAN06-2BLY/497-19090-1-ND/10057130; Temperature: -40...+150°C
VD15 = LED_single: Manufacturer: Wurth; ValueManufacturerPartNumber: LED, 0603, BLUE; PartNumber: 150060BS75000; TypeDiode: LED; Current: 20mA; VoltageDrop: 3.2V; Package: 0603; HelpURL: https://www.digikey.com/product-detail/en/wurth-electronics-inc/150060BS75000/732-4966-1-ND/4489893; Temperature: -55...+150°C
VD16 = LED_single: Manufacturer: Wurth; ValueManufacturerPartNumber: LED, 0603, YELLOW; PartNumber: 150060YS75000; TypeDiode: LED; Current: 20mA; VoltageDrop: 2V; Package: 0603; HelpURL: https://www.digikey.com/product-detail/en/wurth-electronics-inc/150060YS75000/732-4981-1-ND/4489907; Temperature: -55...+150°C
VD17 = USBLC6-2SC6: Manufacturer: ST Microelectronics; ValueManufacturerPartNumber: TVS USB ESD, 5V, SOT23-6L; TypeDiode: TVS USB ESD; Voltage: 5V; Package: SOT23-6L; HelpURL: https://www.digikey.com/product-detail/en/stmicroelectronics/USBLC6-2SC6/497-5235-1-ND/1121688; Temperature: -55...+150°C; PartNumber: USBLC6-2SC6; ClassName: Polygon_direct
VD21 VD22 = Schottky_single: Manufacturer: Vishay; ValueManufacturerPartNumber: Schottky diode, 100V, 1A, , SMA; TypeDiode: Schottky diode; Voltage: 100V; Current: 1A; VoltageDrop: 780mV @ 1A; Package: SMA; HelpURL: https://www.digikey.com/product-detail/en/vishay-semiconductor-diodes-division/VS-10MQ100NTRPBF/10MQ100NPBFCT-ND/812503; Temperature: -55...+150°C; ClassName: Polygon_direct
VT9 = MOSFET_N_TDSON-8: Транзистор; Manufacturer: ON Semiconductor; ValueManufacturerPartNumber: MOSFET N-ch, 100V, 12A, 8-PowerTDFN; CurrentDS: 12A; GateCharge: 55nC @ 10V; MaxPower: 2.5W; RDS: 8mOhm @ 13A, 10V; TypeTransistor: MOSFET N-ch; VoltageDS: 100V; HelpURL: https://www.digikey.com/product-detail/en/on-semiconductor/FDMS86101/FDMS86101CT-ND/2060386; Package: 8-PowerTDFN; Temperature: -55°C ~ 150°C (TJ); ClassName: Polygon_direct
XP7 = IDC-20: Manufacturer: On Shore Technology Inc.; ValueManufacturerPartNumber: Connector IDC, 20pin, 2.54mm; TypeConnector: Connector IDC; VoltageMax: 250VAC; Pitch: 2.54mm; CurrentMax: 3A; Multichannel: 20pin; HelpURL: https://www.digikey.com/product-detail/en/on-shore-technology-inc/302-S201/ED10524-ND/2794235
XP9 = Connector_USB_micro_AB: molex; PartNumber: 0475890001; Manufacturer: Molex; HelpURL: https://www.digikey.com/product-detail/en/molex/0475890001/WM17143DKR-ND/1832257; ValueManufacturerPartNumber: USB micro (AB)
XS1 = PBD-12: Manufacturer: Connfly; ValueManufacturerPartNumber: Connector, 12pin, 2.54mm, 500VAC, 3A; TypeConnector: Connector; VoltageMax: 500VAC; Pitch: 2.54mm; CurrentMax: 3A; Multichannel: 12pin; HelpURL: https://www.chipdip.ru/product/pbd-12; PartNumber: PBD-12
XT5 XT7 = Connector_terminal_2pin: Manufacturer: Molex; ValueManufacturerPartNumber: Terminal connector, 2pin, 3.5mm, 300VAC, 12A; PartNumber: 0393570002; TypeConnector: Terminal connector; VoltageMax: 300VAC; Pitch: 3.5mm; CurrentMax: 12A; Multichannel: 2pin; HelpURL: https://www.digikey.com/product-detail/en/molex/0393570002/WM7877-ND/946543
  XT7: ClassName: Polygon_direct
Z1 = Oscilator_5032: Manufacturer: ECS Inc.; PartNumber: ECS-80-18-30B-AGN-TR; ValueManufacturerPartNumber: Oscilator, 8MHz, 18pF, ±25ppm, case 5032; LoadCapacitance: 18pF; Tolerance: ±25ppm; Package: case 5032; HelpURL: https://www.digikey.com/product-detail/en/ecs-inc/ECS-80-18-30B-AGN-TR/XC2709CT-ND/8023644; Temperature: -40...+85°C; TypeOscilator: Oscilator
Z2 = Crystal_3215: Manufacturer: NDK; PartNumber: NX3215SA-32.768K-20ppm-70KOhm-7pF; ValueManufacturerPartNumber: Crystal, 32.768kHz, 6pF, ±20ppm, case 3215, -40...+85°C; LoadCapacitance: 6pF; Tolerance: ±20ppm; ESR: 70kOhm; Analog: NX3215SA-32.768K-STD-MUA-14 / NDK; Package: case 3215; HelpURL: https://www.chipdip.ru/product0/9000523964; Temperature: -40...+85°C; TypeOscilator: Crystal; HelpURL1: https://www.electronshik.ru/item/NDK/NX3215SA-32.768K-STD-MUA-14